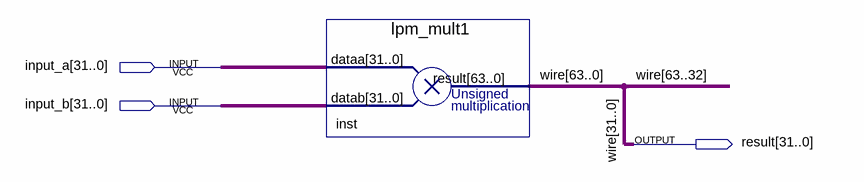
[diagram p0: schematic sheet]
// Quartus schematic custom_instr.bdf as structural Verilog: 1 symbols, 3 pins
module custom_instr (
  input  [31:0] input_a,
  input  [31:0] input_b,
  output [31:0] result
);

  wire [63:32] \wire ;

  lpm_mult1 inst (.dataa(input_a), .datab(input_b), .result({\wire , result}));

  // Other names for the same wires on the sheet: wire[31:0] = result
endmodule
